# EAGLE board avalon_module (EAGLE 6.2), part 1 of 2
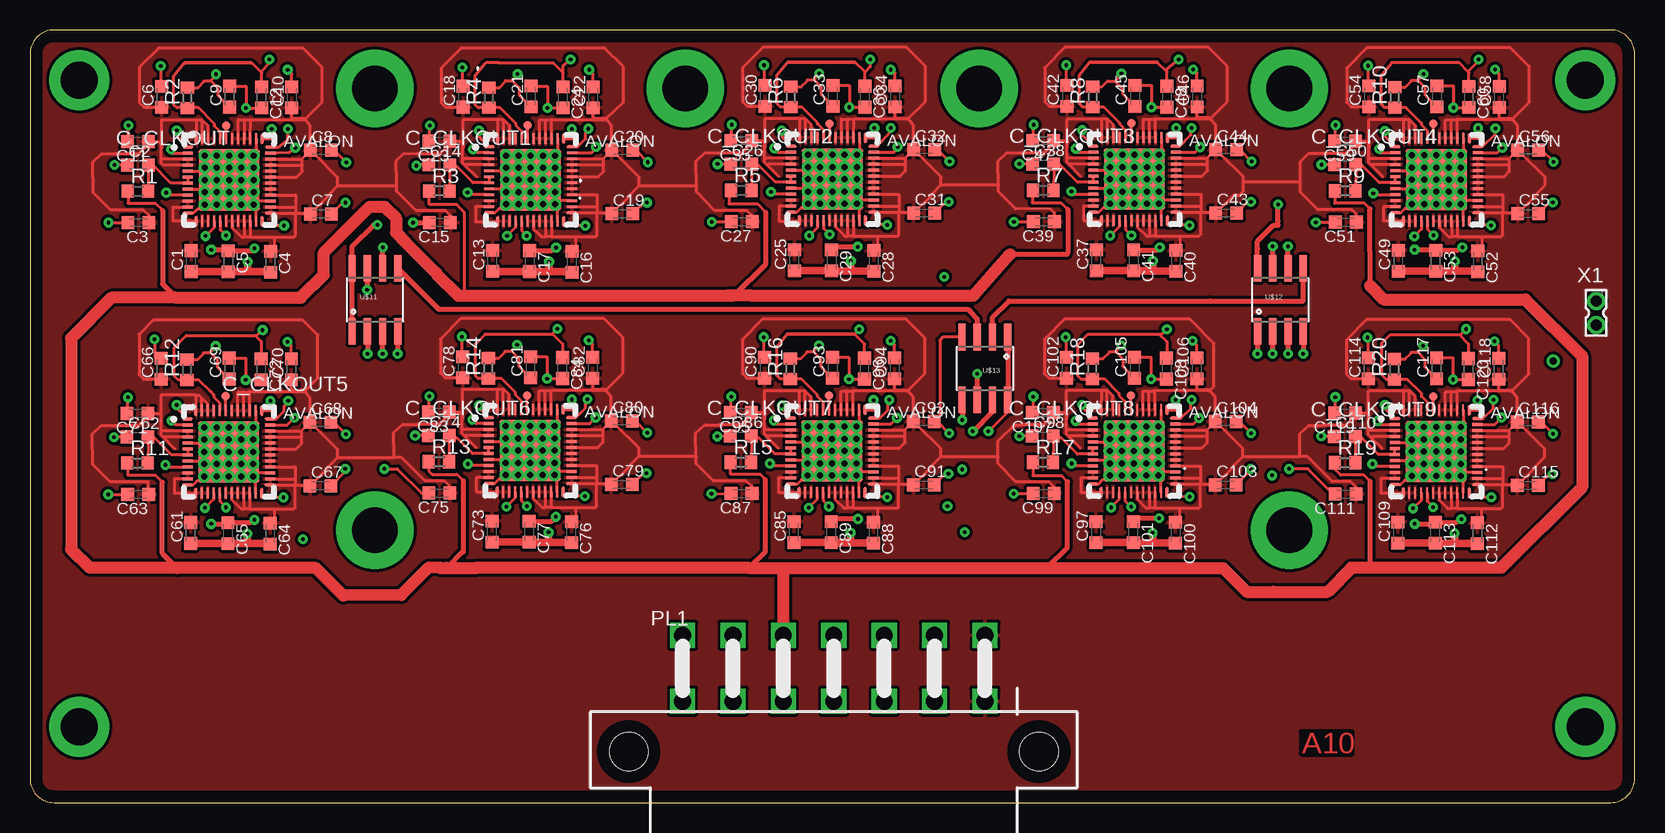
[diagram p7: board, top side]
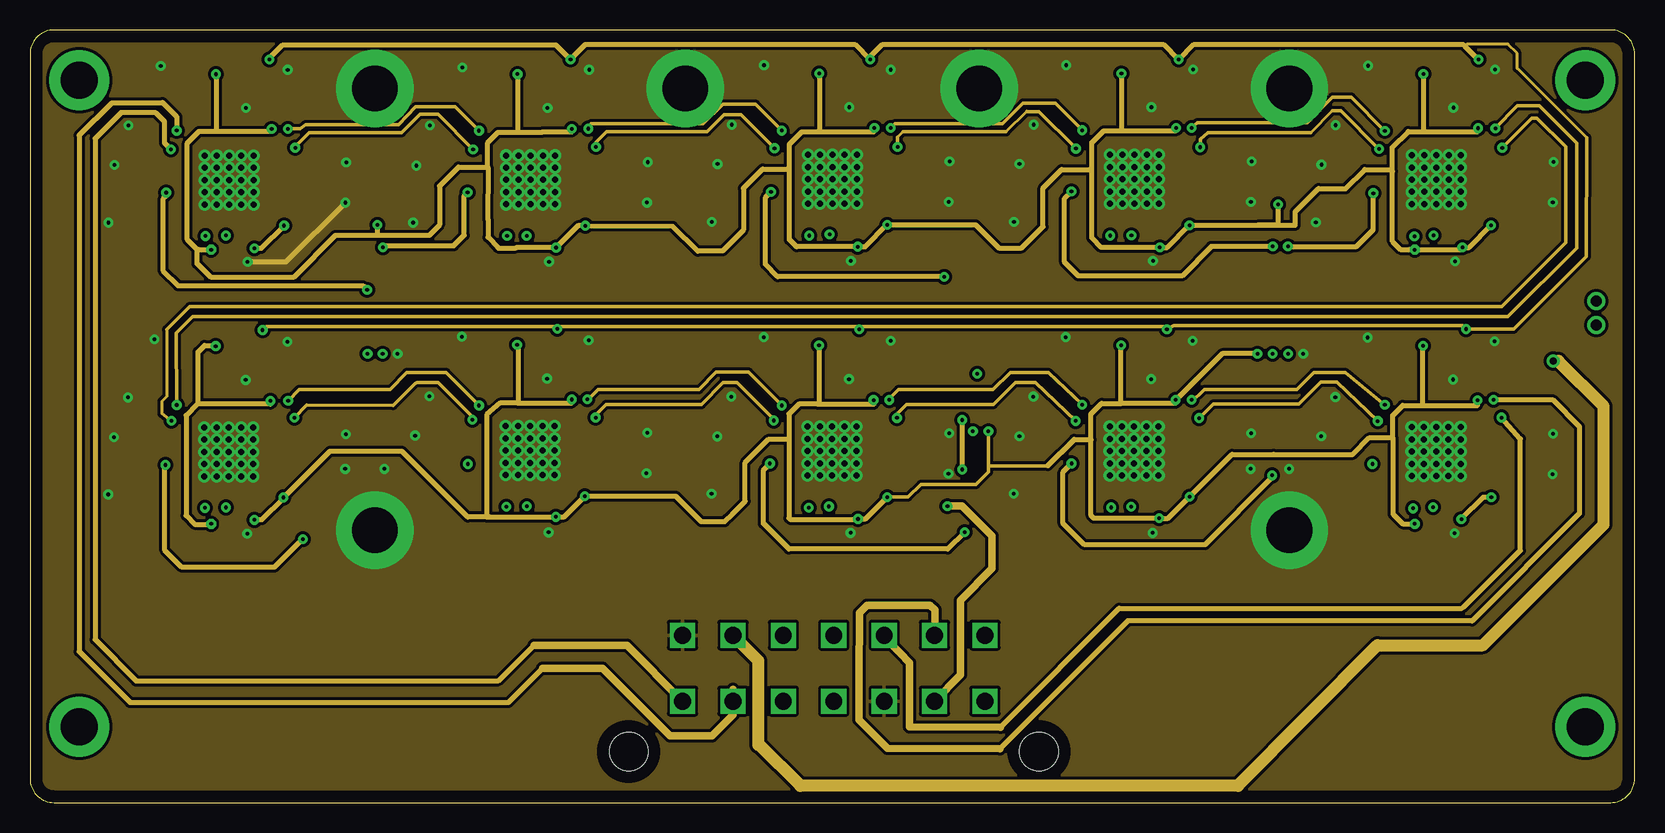
[diagram p8: board, inner layer Route2]
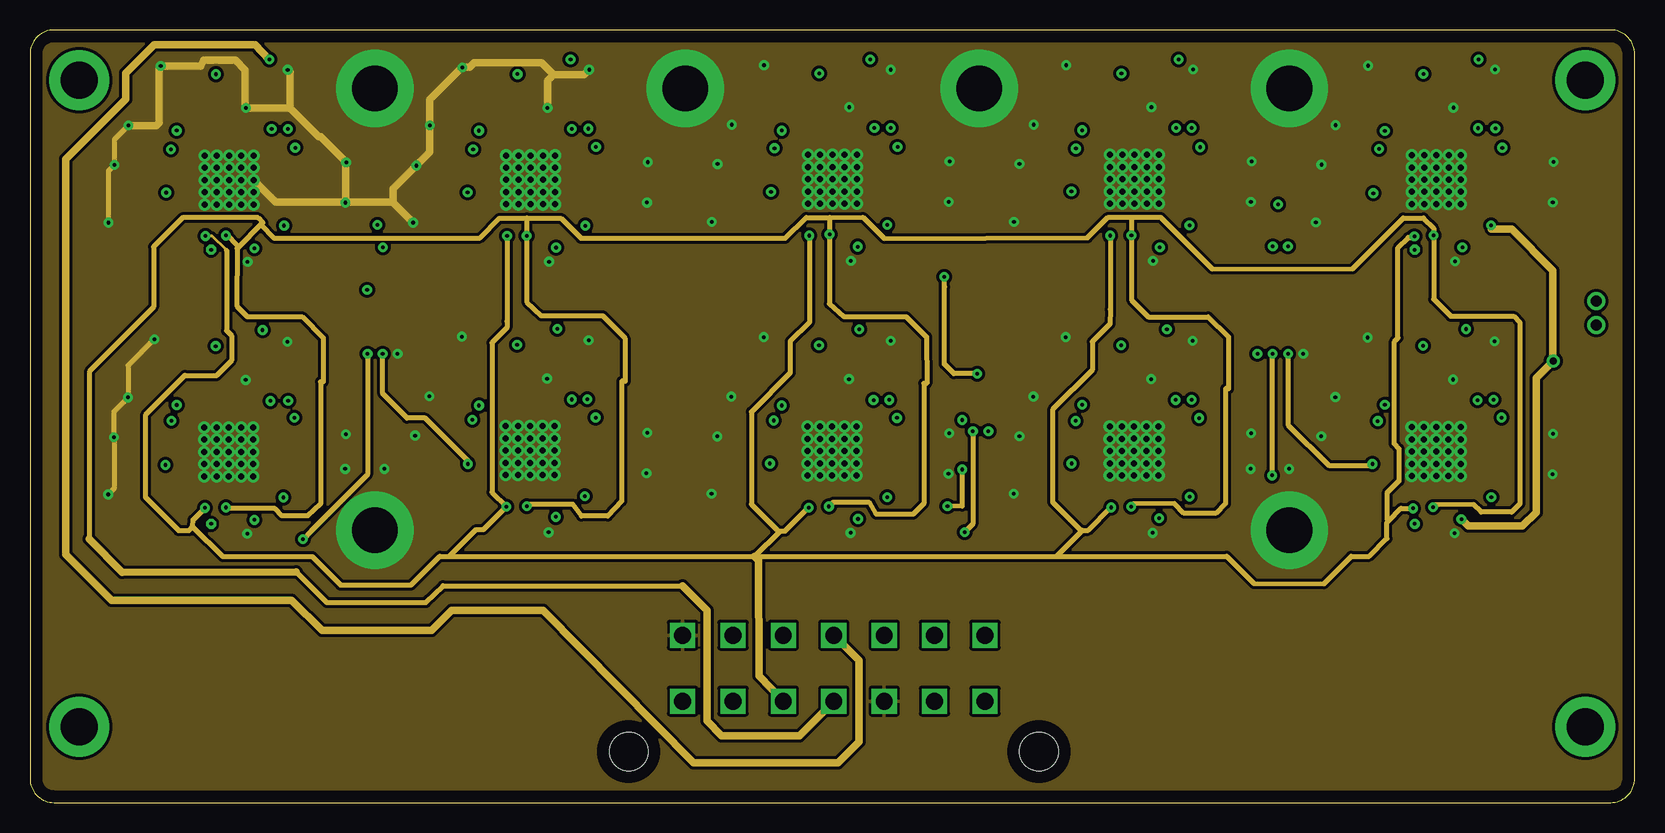
[diagram p9: board, inner layer Route15]
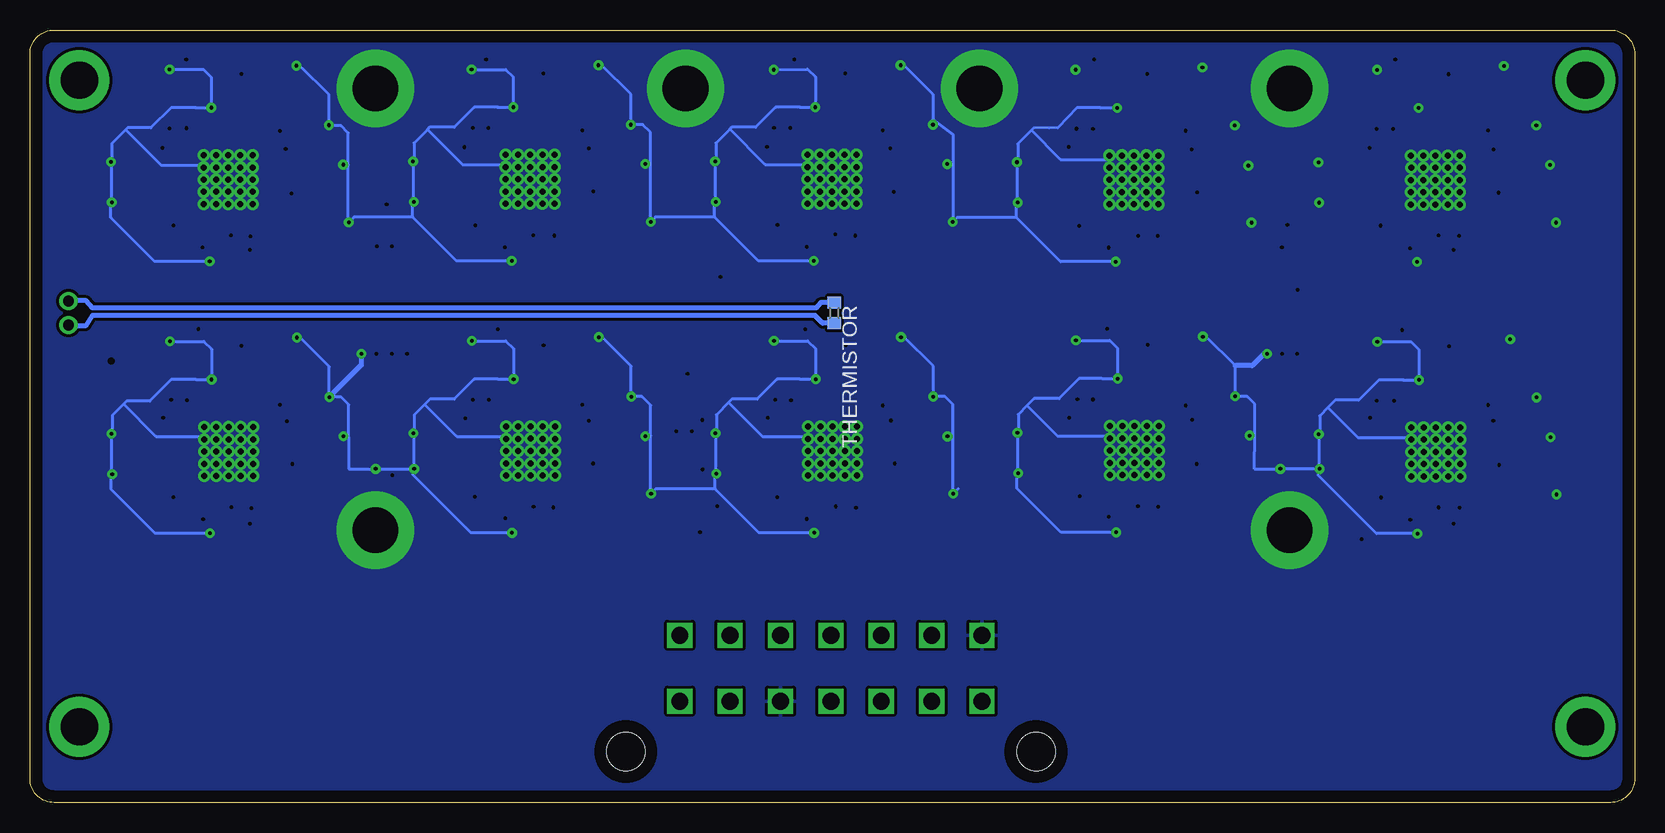
[diagram p10: board, bottom side, seen from below]

Size 133.76 x 64.42 mm. Coordinates in mm from the lower left corner, seen from the top.
Outline: 0,62.42 0,2 arc90 2,0 131.76,0 arc90 133.76,2 133.76,62.42 arc90 131.76,64.42 2,64.42 arc90 0,62.42
Copper layers ((1*2*15)*16): Top 0.035mm / dielectric 1mm / Route2 0.035mm / dielectric 0.3mm / Route15 0.035mm / dielectric 0.3mm / Bottom 0.035mm
Design rules: minimum track width 10mil, minimum drill 24mil, track to track 8mil, track to pad 8mil, pad to pad 8mil, via to via 8mil, smd to smd 8mil, copper to edge 40mil, drill to drill 8mil, minimum pad ring 12mil, minimum via ring 10mil, stop-mask expansion 4mil, vias tented up to drill 0.6mm, thermal gap 10mil

## Footprints (pad centres in the part's own frame; a part is rotated, then mirrored left to right if it is on the bottom)
C0603K = smd 1.05 x 1.08: 1 -0.875,0; 2 0.875,0
TP07R = smd 0.7 x 0.7: TP 0,0
5569-14 = drill 1.4 square: 1 12.6,0; 2 8.4,0; 3 4.2,0; 4 0,0; 5 -4.2,0; 6 -8.4,0; 7 -12.6,0; 8 12.6,5.5; 9 8.4,5.5; 10 4.2,5.5; 11 0,5.5; 12 -4.2,5.5; 13 -8.4,5.5; 14 -12.6,5.5 | hole 3.2: 17.1,-4.2; -17.1,-4.2
R0603 = smd 1 x 1.1: 1 -0.85,0; 2 0.85,0
A3255Q48 = smd 0.925 x 0.25: 1 -3.303,2.54; 2 -3.303,2.04; 3 -3.303,1.54; 4 -3.303,1.04; 5 -3.303,0.54; 6 -3.303,0.04; 7 -3.303,-0.46; 8 -3.303,-0.96; 9 -3.303,-1.46; 10 -3.303,-1.96; 11 -3.303,-2.46; 12 -3.303,-2.96; 25 3.583,-2.96; 26 3.583,-2.46; 27 3.583,-1.96; 28 3.583,-1.46; 29 3.583,-0.96; 30 3.583,-0.46; 31 3.583,0.04; 32 3.583,0.54; 33 3.583,1.04; 34 3.583,1.54; 35 3.583,2.04; 36 3.583,2.54 | smd 0.25 x 0.925: 13 -2.61,-3.652; 14 -2.11,-3.652; 15 -1.61,-3.652; 16 -1.11,-3.652; 17 -0.61,-3.652; 18 -0.11,-3.652; 19 0.39,-3.652; 20 0.89,-3.652; 21 1.39,-3.652; 22 1.89,-3.652; 23 2.39,-3.652; 24 2.89,-3.652; 37 2.89,3.232; 38 2.39,3.232; 39 1.89,3.232; 40 1.39,3.232; 41 0.89,3.232; 42 0.39,3.232; 43 -0.11,3.232; 44 -0.61,3.232; 45 -1.11,3.232; 46 -1.61,3.232; 47 -2.11,3.232; 48 -2.61,3.232 | smd 5.1 x 5.1: 49 0.14,-0.21
SO08 = smd 0.61 x 2.21: 1 -1.905,-2.616; 2 -0.635,-2.616; 3 0.635,-2.616; 4 1.905,-2.616; 5 1.905,2.616; 6 0.635,2.616; 7 -0.635,2.616; 8 -1.905,2.616
332-02 = drill 0.9 pad 1.27: 1 0,-1; 2 0,1

## Placement (x,y rotation side)
C1  470nF  [C0603K]  13.42,45.15 90 top
C2  470nF  [C0603K]  8.99,53.16 0 top
C3  470nF  [C0603K]  9.05,48.36 180 top
C4  470nF  [C0603K]  20.05,45.09 270 top
C5  470nF  [C0603K]  16.53,45.14 270 top
C6  470nF  [C0603K]  10.97,58.85 90 top
C7  470nF  [C0603K]  24.24,49.08 0 top
C8  470nF  [C0603K]  24.24,54.38 0 top
C9  470nF  [C0603K]  16.64,58.86 90 top
C10  470nF  [C0603K]  21.82,58.8 90 top
C11  470nF  [C0603K]  9,55.12 180 top
C12  470nF  [C0603K]  19.3,58.79 270 top
C13  470nF  [C0603K]  38.55,45.16 90 top
C14  470nF  [C0603K]  34.12,53.17 0 top
C15  470nF  [C0603K]  34.18,48.37 180 top
C16  470nF  [C0603K]  45.18,45.1 270 top
C17  470nF  [C0603K]  41.66,45.15 270 top
C18  470nF  [C0603K]  36.1,58.86 90 top
C19  470nF  [C0603K]  49.37,49.09 0 top
C20  470nF  [C0603K]  49.37,54.39 0 top
C21  470nF  [C0603K]  41.77,58.87 90 top
C22  470nF  [C0603K]  46.95,58.81 90 top
C23  470nF  [C0603K]  34.13,55.13 180 top
C24  470nF  [C0603K]  44.43,58.8 270 top
C25  470nF  [C0603K]  63.71,45.22 90 top
C26  470nF  [C0603K]  59.28,53.23 0 top
C27  470nF  [C0603K]  59.34,48.43 180 top
C28  470nF  [C0603K]  70.34,45.16 270 top
C29  470nF  [C0603K]  66.82,45.21 270 top
C30  470nF  [C0603K]  61.26,58.92 90 top
C31  470nF  [C0603K]  74.53,49.15 0 top
C32  470nF  [C0603K]  74.53,54.45 0 top
C33  470nF  [C0603K]  66.93,58.93 90 top
C34  470nF  [C0603K]  72.11,58.87 90 top
C35  470nF  [C0603K]  59.29,55.19 180 top
C36  470nF  [C0603K]  69.59,58.86 270 top
C37  470nF  [C0603K]  88.89,45.22 90 top
C38  470nF  [C0603K]  84.46,53.23 0 top
C39  470nF  [C0603K]  84.52,48.43 180 top
C40  470nF  [C0603K]  95.52,45.16 270 top
C41  470nF  [C0603K]  92,45.21 270 top
C42  470nF  [C0603K]  86.44,58.92 90 top
C43  470nF  [C0603K]  99.71,49.15 0 top
C44  470nF  [C0603K]  99.71,54.45 0 top
C45  470nF  [C0603K]  92.11,58.93 90 top
C46  470nF  [C0603K]  97.29,58.87 90 top
C47  470nF  [C0603K]  84.47,55.19 180 top
C48  470nF  [C0603K]  94.77,58.86 270 top
C49  470nF  [C0603K]  114.06,45.18 90 top
C50  470nF  [C0603K]  109.63,53.19 0 top
C51  470nF  [C0603K]  109.69,48.39 180 top
C52  470nF  [C0603K]  120.69,45.12 270 top
C53  470nF  [C0603K]  117.17,45.17 270 top
C54  470nF  [C0603K]  111.61,58.88 90 top
C55  470nF  [C0603K]  124.88,49.11 0 top
C56  470nF  [C0603K]  124.88,54.41 0 top
C57  470nF  [C0603K]  117.28,58.89 90 top
C58  470nF  [C0603K]  122.46,58.83 90 top
C59  470nF  [C0603K]  109.64,55.15 180 top
C60  470nF  [C0603K]  119.94,58.82 270 top
C61  470nF  [C0603K]  13.39,22.48 90 top
C62  470nF  [C0603K]  8.96,30.49 0 top
C63  470nF  [C0603K]  9.02,25.69 180 top
C64  470nF  [C0603K]  20.02,22.42 270 top
C65  470nF  [C0603K]  16.5,22.47 270 top
C66  470nF  [C0603K]  10.94,36.18 90 top
C67  470nF  [C0603K]  24.21,26.41 0 top
C68  470nF  [C0603K]  24.21,31.71 0 top
C69  470nF  [C0603K]  16.61,36.19 90 top
C70  470nF  [C0603K]  21.79,36.13 90 top
C71  470nF  [C0603K]  8.97,32.45 180 top
C72  470nF  [C0603K]  19.27,36.12 270 top
C73  470nF  [C0603K]  38.51,22.59 90 top
C74  470nF  [C0603K]  34.08,30.6 0 top
C75  470nF  [C0603K]  34.14,25.8 180 top
C76  470nF  [C0603K]  45.14,22.53 270 top
C77  470nF  [C0603K]  41.62,22.58 270 top
C78  470nF  [C0603K]  36.06,36.29 90 top
C79  470nF  [C0603K]  49.33,26.52 0 top
C80  470nF  [C0603K]  49.33,31.82 0 top
C81  470nF  [C0603K]  41.73,36.3 90 top
C82  470nF  [C0603K]  46.91,36.24 90 top
C83  470nF  [C0603K]  34.09,32.56 180 top
C84  470nF  [C0603K]  44.39,36.23 270 top
C85  470nF  [C0603K]  63.68,22.55 90 top
C86  470nF  [C0603K]  59.25,30.56 0 top
C87  470nF  [C0603K]  59.31,25.76 180 top
C88  470nF  [C0603K]  70.31,22.49 270 top
C89  470nF  [C0603K]  66.79,22.54 270 top
C90  470nF  [C0603K]  61.23,36.25 90 top
C91  470nF  [C0603K]  74.5,26.48 0 top
C92  470nF  [C0603K]  74.5,31.78 0 top
C93  470nF  [C0603K]  66.9,36.26 90 top
C94  470nF  [C0603K]  72.08,36.2 90 top
C95  470nF  [C0603K]  59.26,32.52 180 top
C96  470nF  [C0603K]  69.56,36.19 270 top
C97  470nF  [C0603K]  88.86,22.55 90 top
C98  470nF  [C0603K]  84.43,30.56 0 top
C99  470nF  [C0603K]  84.49,25.76 180 top
C100  470nF  [C0603K]  95.49,22.49 270 top
C101  470nF  [C0603K]  91.97,22.54 270 top
C102  470nF  [C0603K]  86.41,36.25 90 top
C103  470nF  [C0603K]  99.68,26.48 0 top
C104  470nF  [C0603K]  99.68,31.78 0 top
C105  470nF  [C0603K]  92.08,36.26 90 top
C106  470nF  [C0603K]  97.26,36.2 90 top
C107  470nF  [C0603K]  84.44,32.52 180 top
C108  470nF  [C0603K]  94.74,36.19 270 top
C109  470nF  [C0603K]  114.03,22.51 90 top
C110  470nF  [C0603K]  109.6,30.52 0 top
C111  470nF  [C0603K]  109.66,25.72 180 top
C112  470nF  [C0603K]  120.66,22.45 270 top
C113  470nF  [C0603K]  117.14,22.5 270 top
C114  470nF  [C0603K]  111.58,36.21 90 top
C115  470nF  [C0603K]  124.85,26.44 0 top
C116  470nF  [C0603K]  124.85,31.74 0 top
C117  470nF  [C0603K]  117.25,36.22 90 top
C118  470nF  [C0603K]  122.43,36.16 90 top
C119  470nF  [C0603K]  109.61,32.48 180 top
C120  470nF  [C0603K]  119.91,36.15 270 top
C_CLKOUT  PTR1TP07R  [TP07R]  16.36,56.46 180 top
C_CLKOUT1  PTR1TP07R  [TP07R]  41.48,56.48 180 top
C_CLKOUT2  PTR1TP07R  [TP07R]  66.65,56.62 180 top
C_CLKOUT3  PTR1TP07R  [TP07R]  91.82,56.64 180 top
C_CLKOUT4  PTR1TP07R  [TP07R]  116.99,56.59 180 top
C_CLKOUT5  PTR1TP07R  [TP07R]  16.32,33.88 0 top
C_CLKOUT6  PTR1TP07R  [TP07R]  41.45,33.95 180 top
C_CLKOUT7  PTR1TP07R  [TP07R]  66.62,33.96 180 top
C_CLKOUT8  PTR1TP07R  [TP07R]  91.79,33.94 180 top
C_CLKOUT9  PTR1TP07R  [TP07R]  116.96,33.84 180 top
PL1  [5569-14]  67,8.45 0 top
R1  75  [R0603]  9,50.98 0 top
R2  100K  [R0603]  13.12,58.76 90 top
R3  75  [R0603]  34.13,50.99 0 top
R4  100K  [R0603]  38.25,58.77 90 top
R5  75  [R0603]  59.29,51.05 0 top
R6  100K  [R0603]  63.41,58.83 90 top
R7  75  [R0603]  84.47,51.05 0 top
R8  100K  [R0603]  88.59,58.83 90 top
R9  75  [R0603]  109.64,51.01 0 top
R10  100K  [R0603]  113.76,58.79 90 top
R11  75  [R0603]  8.97,28.31 0 top
R12  100K  [R0603]  13.09,36.09 90 top
R13  75  [R0603]  34.09,28.42 0 top
R14  100K  [R0603]  38.21,36.2 90 top
R15  75  [R0603]  59.26,28.38 0 top
R16  100K  [R0603]  63.38,36.16 90 top
R17  75  [R0603]  84.44,28.38 0 top
R18  100K  [R0603]  88.56,36.16 90 top
R19  75  [R0603]  109.61,28.34 0 top
R20  100K  [R0603]  113.73,36.12 90 top
THERMISTOR  100K  [R0603]  66.72,40.82 270 bottom
U$1  A3255Q48  [A3255Q48]  16.46,52.12 0 top
U$2  A3255Q48  [A3255Q48]  41.59,52.13 0 top
U$3  A3255Q48  [A3255Q48]  66.75,52.19 0 top
U$4  A3255Q48  [A3255Q48]  91.93,52.19 0 top
U$5  A3255Q48  [A3255Q48]  117.1,52.15 0 top
U$6  A3255Q48  [A3255Q48]  16.43,29.45 0 top
U$7  A3255Q48  [A3255Q48]  41.55,29.56 0 top
U$8  A3255Q48  [A3255Q48]  66.72,29.52 0 top
U$9  A3255Q48  [A3255Q48]  91.9,29.52 0 top
U$10  A3255Q48  [A3255Q48]  117.07,29.48 0 top
U$11  NB3L553  [SO08]  28.76,41.92 0 top
U$12  NB3L553  [SO08]  104.23,41.92 0 top
U$13  NB3L553  [SO08]  79.6,36.2 180 top
X1  332-02  [332-02]  130.55,40.82 180 top

## Tracks (layer width: path | path; a pad name or v marks a point on that pad's centre or on a via)
$1
  Top 0.254: R3.2 34.99,52.73 C14.2 34.94,53.19 34.98,53.15 35.46,53.15 36.88,51.73 36.93,51.68 U$2.7 U$2.6
$2
  Top 0.254: R5.2 60.16,52.79 C26.2 60.63,53.23 62.09,51.78 62.12,51.74 U$3.7 U$3.6
$3
  Top 0.254: R1.2 9.87,52.72 C2.2 10.17,53.16 10.17,53.22 11.74,51.66 U$1.7 U$1.6
$4
  Top 0.254: R7.2 85.33,52.79 C38.2 85.83,53.23 87.33,51.73 U$4.7 U$4.6
$5
  Top 0.254: R9.2 110.5,52.75 C50.2 110.98,53.2 112.47,51.71 112.49,51.69 U$5.7 U$5.6
$6
  Top 0.254: R11.2 9.83,30.05 C62.2 9.89,30.43 10.36,30.43 11.8,28.99 U$6.7 U$6.6
$7
  Top 0.254: R13.2 34.95,30.16 C74.2 35.17,30.38 35.6,30.38 36.88,29.1 U$7.7 U$7.6
$8
  Top 0.254: R15.2 60.12,30.12 C86.2 60.3,30.39 60.76,30.4 62.09,29.07 U$8.7 U$8.6
$9
  Top 0.254: R17.2 85.3,30.12 C98.2 85.42,30.44 85.92,30.44 87.3,29.06 U$9.7 U$9.6
$10
  Top 0.254: R19.2 110.47,30.08 C110.2 110.59,30.4 111.03,30.4 112.41,29.02 U$10.7 U$10.6
AVCC1V2
  Top 0.254: R1.1 8.18,50.98 8.18,49.97 10.45,49.97 11.06,49.39 | R3.1 33.28,49.87 35.57,49.87 36.2,49.21 36.2,42.29 35.71,42.27 | R5.1 58.27,51.05 58.27,49.92 60.64,49.92 61.35,49.21 | R7.1 83.55,51.05 83.55,50.02 85.93,50.02 86.52,49.45 | R9.1 108.76,51.01 108.76,49.97 108.77,49.98 111.23,49.98 111.7,49.51 | R19.1 108.62,28.34 108.62,27.93 109.25,27.3 111.2,27.3 111.71,26.78 | R17.1 83.6,27.24 83.61,27.25 86,27.25 86.49,26.75 | 86.13,19.57 86.03,19.55 86.25,19.52 86.13,19.57 | 86.29,19.57 86.13,19.57 | 86.13,19.57 86.06,19.56 | R13.1 33.24,27.67 33.54,27.37 35.59,27.37 36.12,26.85 | 37.2,19.57 37.21,19.56 | R11.1 8.15,28.31 8.15,27.3 8.16,27.29 10.47,27.29 11.03,26.73 | 34.2,19.56 34.2,19.57 | R15.1 58.4,27.38 58.41,27.37 60.88,27.37 61.3,26.93 | 62.8,19.41 62.65,19.56 | 11.06,43.26 11.13,43.16 | 36.12,20.89 36.06,20.92
  Top 0.406: 11.12,43.14 11.13,43.16 12.2,42.09 | 58.67,42.29 61.35,44.92 61.35,49.21 | 86.52,49.45 86.52,45.85 86.47,45.73 81.69,45.73 | 111.72,19.58 111.72,19.57 | 84.79,19.56 86.48,21.24 86.49,26.75 | 59.95,19.56 61.3,20.91 61.3,26.93 | 36.06,20.92 34.71,19.57 | 12.19,19.59 12.24,19.56 11.03,20.78 11.03,26.73 | 11.06,49.39 11.06,43.26 | 36.12,26.85 36.12,20.89 | 111.72,19.58 111.71,26.78 | 88.34,19.55 | 111.7,49.51 111.7,45.91 111.7,43.09 | 111.73,19.57 111.72,19.58
  Top 1.016: 58.06,42.27 35.71,42.27 33.87,44.11 33.87,44.15 31.29,46.75 30.5,47.54 30.5,48.76 29.58,49.68 28.33,49.68 24.49,45.84 24.49,44 22.58,42.09 12.2,42.09 6.79,42.09 3.43,38.73 3.43,21.12 4.98,19.59 12.19,19.59 | 58.06,42.27 58.67,42.29 | 111.72,19.57 110.13,19.57 108.18,17.58 103.62,17.57 101.43,17.58 99.45,19.55 88.34,19.55 | 86.03,19.55 88.34,19.55 | 86.06,19.56 84.79,19.56 62.65,19.56 59.95,19.56 37.21,19.56 | 34.2,19.57 34.71,19.57 37.2,19.57 | PL1.12 62.8,19.41 | 34.2,19.56 33.24,19.59 30.95,17.3 26.12,17.27 23.83,19.56 12.24,19.56 | 81.69,45.73 78.64,42.27 60.18,42.27 58.08,42.27 58.06,42.27 | 111.7,43.09 112.83,41.96 124.66,41.96 129.38,37.24 129.38,26.29 122.66,19.57 111.73,19.57
AVCC3V3  (via drill 0.3 layers 1-15, 0.3 pad 0.25 layers 1-15, 0.3 pad 0.3 layers 1-15, 0.6 layers 1-15)
  Top 0.254: R2.2 14,59.61 14.53,60.14 14.53,60.16 14.5,60.19 15.06,60.19 | 15.06,60.19 15.65,59.6 15.65,58.98 C9.1 | U$1.37 20.15,55.35 v20.15,56.18 | v15.51,60.73 15.51,60.64 15.06,60.19 | R4.2 39.13,59.62 39.66,60.15 39.66,60.17 39.63,60.2 40.19,60.2 | 40.19,60.2 40.78,59.61 40.78,58.99 C21.1 | U$2.37 45.2,55.36 v45.16,56.18 | v40.64,60.74 40.64,60.65 40.19,60.2 | R6.2 64.29,59.68 64.82,60.21 64.82,60.23 64.79,60.26 65.35,60.26 | 65.35,60.26 65.94,59.67 65.94,59.05 C33.1 | U$3.37 70.36,55.42 v70.39,56.25 | v65.8,60.8 65.8,60.71 65.35,60.26 | C45.1 91.12,59.05 91.12,59.48 90.44,60.16 | U$4.37 95.54,55.42 v95.54,56.26 | 90.98,60.71 v90.98,60.8 91.12,60.66 90.94,60.66 90.44,60.16 | R10.2 114.64,59.64 115.17,60.17 115.17,60.19 115.14,60.22 115.7,60.22 | 115.7,60.22 116.29,59.63 116.29,59.01 C57.1 | U$5.37 120.71,55.38 v120.72,56.23 | v116.15,60.76 116.15,60.67 115.7,60.22 | R20.2 114.61,36.97 115.14,37.5 115.14,37.52 115.11,37.55 115.67,37.55 | 115.67,37.55 116.26,36.96 116.26,36.34 C117.1 | U$10.37 120.68,32.71 v120.67,33.55 | v116.12,38.09 116.12,38 115.67,37.55 | R18.2 89.44,37.01 89.97,37.54 89.97,37.56 89.94,37.59 90.5,37.59 | 90.5,37.59 91.09,37 91.09,36.38 C105.1 | U$9.37 95.51,32.75 v95.51,33.57 | v90.95,38.13 90.95,38.04 90.5,37.59 | R16.2 64.26,37.01 64.79,37.54 64.79,37.56 64.76,37.59 65.32,37.59 | 65.32,37.59 65.91,37 65.91,36.38 C93.1 | U$8.37 70.33,32.75 v70.32,33.56 | v65.77,38.13 65.77,38.04 65.32,37.59 | R14.2 39.09,37.05 39.62,37.58 39.62,37.6 39.59,37.63 40.15,37.63 | 40.15,37.63 40.74,37.04 40.74,36.42 C81.1 | U$7.37 45.16,32.79 v45.16,33.61 | v40.6,38.17 40.6,38.08 40.15,37.63
  Top 0.254: R12.2 13.97,36.94 14.5,37.47 14.5,37.49 14.47,37.52 15.03,37.52 | 15.03,37.52 15.62,36.93 15.62,36.31 C69.1 | U$6.37 20.04,32.68 v20.04,33.49 | v15.48,38.06 15.48,37.97 15.03,37.52 | 116.7,23.24 C113.1 | 116.7,46.1 C53.1 | 16.37,23.24 C65.1 | 16.37,46.1 C5.1 | 18.59,46.02 v18.71,46.22 | v21.18,48.11 19.35,48.12 U$1.24 | 44.5,48.46 U$2.24 44.48,48.1 v46.3,48.1 | v21.13,25.44 19.31,25.43 U$6.24 | v71.45,48.17 69.65,48.18 U$3.24 | v96.65,48.14 94.82,48.14 U$4.24 | v121.8,48.13 119.99,48.13 U$5.24 | v46.26,25.55 44.44,25.54 U$7.24 | v71.47,25.47 69.6,25.48 U$8.24 | v96.67,25.51 94.79,25.49 U$9.24 | v121.81,25.45 119.96,25.46 U$10.24 | C29.1 66.82,46.26 66.91,46.35 | 91.97,23.7 C101.1 | 66.79,23.65 C89.1 | R8.2 89.34,59.68 89.82,60.16 90.44,60.16 | U$13.8 81.5,32.58 v79.89,30.96
  Top 0.305: 70.34,55.96 v70.39,56.25 70.37,55.96 | v95.54,56.26 95.53,55.96 95.52,55.96 | v120.67,33.55 120.67,33.25 120.66,33.25
  Top 0.406: v115.43,23.24 116.7,23.24 | v115.43,46.1 116.7,46.1 | v15.1,46.1 16.37,46.1 | C5.1 18.59,46.02 | C17.1 43.53,46.03 v43.85,46.27 | v18.7,23.57 18.31,23.35 C65.1 16.5,23.24 v15.1,23.24 | C53.1 119.02,46.05 v119.4,46.29 | C113.1 118.91,23.38 v119.32,23.64 | 66.91,46.35 v69.01,46.35 | C41.1 93.97,46.09 v94.18,46.29 | v94.13,23.7 91.97,23.7 | v69.02,23.65 66.79,23.65 | C77.1 43.46,23.46 v43.83,23.82 | v28.95,48.18 28.64,48.18 28.64,48.16 26.86,46.4 U$11.8 U$11.1 | U$12.8 102.32,46.19 102.32,46.8 103.66,48.14 104.03,48.14 104.03,48.47 v104.03,49.88 | U$13.1 U$13.8 | U$12.1 102.33,37.4 v102.32,37.43
  Route2 0.254: 70.34,55.94 v70.39,56.25 | 95.48,56.02 v95.54,56.26 | 13.92,46.12 14.06,46.12 13.92,45.98 | 15.08,46.12 v15.1,46.1 15.13,46.07 | 65.8,56.09 65.65,55.94 | 63.11,52.83 63.3,52.65 | 88.33,52.79 88.52,52.6 | 120.69,55.9 v120.72,56.23 120.67,55.96 | 113.5,52.78 113.56,52.84 | 42.68,55.88 42.7,55.9 | 40.64,56.02 40.78,55.88 | 19.98,55.98 v20.15,56.18 | 15.51,56.04 15.57,55.98 | 90.98,56.08 90.92,56.02 | 38.21,52.86 38.16,52.99 | 46.33,48.07 v46.3,48.1 | 21.22,48.07 v21.18,48.11 | 15.43,38.11 v15.48,38.06 | 15.07,23.21 v15.1,23.24 | v21.13,25.44 21.13,25.37 | 14.02,33.3 13.94,33.22 | v40.6,38.17 40.68,38.17 | 45.16,33.3 v45.16,33.61 45.13,33.3 | 65.75,33.23 65.67,33.23 65.77,33.33 | 68.96,23.59 v69.02,23.65 | 58.6,24.06 58.58,24.09 | 70.33,33.23 v70.32,33.56 | 90.97,33.29 90.95,33.29 | v94.14,23.7 v94.13,23.7 | 95.49,33.29 v95.51,33.57 | 113.64,30.36 113.6,30.4 | 94.87,23.7 94.87,23.71 | v115.42,46.11 v115.43,46.1
  Route2 0.305: v71.47,25.47 73.2,25.47 74.26,26.53 78.08,26.53 78.85,26.53 79.88,27.56 79.88,28.08 | 79.88,28.08 v79.88,30.95 v79.89,30.96 | 84.83,28.07 79.89,28.07 79.88,28.08
  Route2 0.406: 70.34,55.94 65.65,55.94 64.34,55.94 63.31,54.89 63.3,52.65 63.3,46.94 63.91,46.35 v69.01,46.35 69.63,46.35 v71.45,48.17 78.83,48.17 80.76,46.24 82.66,46.24 84.44,48.02 84.44,51.24 85.99,52.79 88.33,52.79 | 95.48,56.02 90.92,56.02 89.51,56.02 88.52,55.03 88.52,52.6 88.52,47.07 89.29,46.29 v94.18,46.29 94.8,46.29 v96.65,48.14 102.3,48.14 | 13.92,46.12 13.11,46.93 13.11,55 14.09,55.98 15.57,55.98 19.98,55.98 | 14.06,46.12 15.08,46.12 | v65.8,60.8 65.8,56.09 | v46.3,48.1 45.68,48.1 v43.85,46.27 40.51,46.27 40.49,46.25 38.98,46.25 39.02,46.29 38.18,47.13 38.18,48.63 38.21,52.86 | v121.81,25.45 121.13,25.45 v119.32,23.64 | v69.02,23.65 69.65,23.65 v71.47,25.47 | 28.95,47.29 33.29,47.29 34.13,48.16 34.13,51.41 35.71,52.99 38.16,52.99 38.16,55.02 39.02,55.88 40.78,55.88 42.68,55.88 | 28.95,47.29 25.44,47.29 21.96,43.78 15.11,43.78 13.92,44.92 13.92,45.98 | 63.11,52.83 61.08,52.83 59.47,51.22 59.47,47.74 57.73,46 55.65,45.97 53.58,48.04 46.33,48.07 | 102.3,48.14 104.03,48.14 | 104.03,48.14 105.33,48.14 105.46,48.14 105.46,49.26 107.4,51.2 109.65,51.2 109.66,51.19 111.25,52.78 113.5,52.78 113.57,52.64 113.57,46.78 114.24,46.11 v115.42,46.11 | 113.56,52.84 113.56,54.64 114.88,55.96 116.15,55.96 | 116.15,55.96 120.67,55.96 | v45.16,56.18 v45.17,56.18 45.17,55.91 42.7,55.9 | v40.64,60.74 40.64,56.02 | v15.51,60.73 15.51,56.04 | 114.95,46.1 v115.43,46.1 119.21,46.1 v119.4,46.29 119.96,46.29 v121.8,48.13 | v116.15,60.76 116.15,55.96 | v90.98,60.8 90.98,56.08 | v18.71,46.22 19.29,46.22 v21.18,48.11 | 14.02,33.3 14.02,37.58 14.55,38.11 15.43,38.11 | v20.04,33.49 20.04,33.23 13.94,33.22 13,32.28 13,23.92 13.71,23.21 15.07,23.21
  Route2 0.406: 21.13,25.37 19.33,23.58 18.86,23.58 v18.7,23.57 18.65,23.62 | 40.68,38.17 40.68,33.3 | 40.68,33.3 39.18,33.3 38.08,32.36 38.08,23.8 | 38.08,23.8 38.37,23.81 36.48,23.81 31,29.29 24.98,29.29 v21.13,25.44 | 38.08,23.8 43.4,23.81 v43.83,23.82 44.53,23.82 v46.26,25.55 53.82,25.55 55.95,23.42 57.91,23.42 58.58,24.09 59.61,25.12 59.61,28.34 61.58,30.31 63.27,30.31 | 40.68,33.3 45.13,33.3 | 65.67,33.23 64.1,33.23 63.27,32.4 63.27,30.31 | 63.27,30.31 63.27,23.73 63.41,23.59 68.96,23.59 | v65.77,38.13 65.77,33.33 | 65.75,33.23 70.33,33.23 | 95.49,33.29 90.97,33.29 89.33,33.29 88.43,32.4 88.42,30.29 | 90.95,33.29 v90.95,38.13 | 84.83,28.07 87.05,30.29 88.42,30.29 | 88.42,30.29 88.45,30.26 88.45,23.93 88.68,23.7 v94.13,23.7 94.87,23.7 | 116.12,33.11 v116.12,38.09 116.16,38.05 | 116.12,33.11 120.68,33.11 v120.67,33.55 | 116.12,33.11 114.42,33.11 113.6,32.29 113.6,30.4 113.58,30.4 113.58,30.41 113.55,30.44 111.66,30.44 110.28,29.04 103.66,29.03 100.19,29.03 v96.67,25.51 94.87,23.71 | 113.64,30.36 113.64,24.03 114.43,23.24 v115.43,23.24 | v28.95,48.18 28.95,47.29 | v104.03,49.88 104.03,48.14 | 104.03,48.14 102.3,48.14 | v102.32,37.43 99.38,37.44 98.26,36.32 v95.51,33.57
  Route2 1.016: v126.98,36.82 127.4,36.82 131.17,33.05 131.17,23.17 121.12,13.12 112.33,13.12 100.7,1.38 64.22,1.38 60.76,4.81 60.71,4.81 60.71,11.82 58.6,13.93 PL1.13
  Route15 0.61: v119.32,23.64 119.89,23.07 124.41,23.07 125.55,24.21 125.55,35.39 v126.98,36.82 126.94,36.86 126.94,44.37 123.5,47.81 121.8,47.81 v121.8,48.13
CLK  (via drill 0.3 layers 1-15)
  Top 0.406: U$13.5 77.71,33.58 v77.71,31.9
  Route2 0.406: v77.71,31.9 77.69,31.9 v77.7,27.77
  Route2 0.61: PL1.2 77.55,10.64 77.55,16.84 80.2,19.51 80.2,22.22 78.15,24.27 77.7,24.72 v76.48,24.72
  Route15 0.406: v77.7,27.77 v77.69,27.77 77.69,24.71 v76.48,24.72
CLK1  (via drill 0.3 layers 1-15)
  Top 0.254: U$1.9 11.55,50.66 v11.35,50.86
  Top 0.406: U$11.7 28.1,44.54 v28.1,42.76
  Route2 0.406: v11.35,50.86 11.35,50.58 11.07,50.3 11.07,44.36 12.34,43.09 27.77,43.09 v28.1,42.76
CLK2  (via drill 0.3 layers 1-15)
  Top 0.254: 36.74,50.68 36.54,50.88 v36.48,50.88 36.69,50.67 U$2.9
  Top 0.406: U$11.6 v29.41,46.29
  Route2 0.406: v29.41,46.29 29.41,46.24 29.61,46.44 35.33,46.44 36.19,47.3 36.19,50.59 v36.48,50.88
CLK3  (via drill 0.3 layers 1-15)
  Top 0.254: U$3.9 61.91,50.73 v61.77,50.92
  Top 0.406: U$13.6 78.97,35.75 v78.95,35.76
  Route2 0.406: v76.2,43.84 62.33,43.84 61.31,44.88 61.32,50.47 v61.77,50.92
  Route15 0.406: v78.95,35.76 77.01,35.76 76.21,36.56 76.21,39.74 76.24,43 76.24,43.82 v76.2,43.84
CLK4  (via drill 0.3 layers 1-15)
  Top 0.254: v86.81,50.95 86.81,50.92 86.99,50.74 88.62,50.74 U$4.9
  Top 0.406: U$12.7 103.59,46.33 v103.6,46.37
  Route2 0.406: v103.6,46.37 98.47,46.37 96.05,43.91 87.38,43.91 86.24,45.05 86.24,50.39 v86.81,50.95
CLK5  (via drill 0.3 layers 1-15)
  Top 0.254: v111.98,50.81 v111.97,50.81 112.08,50.7 113.79,50.7 U$5.9
  Top 0.406: U$12.6 v104.86,46.37
  Route2 0.406: v104.86,46.37 110.57,46.37 111.97,47.77 v111.97,50.8 v111.98,50.81
CLK6  (via drill 0.3 layers 1-15)
  Top 0.254: v11.3,28.15 11.28,28.15 11.28,27.99 U$6.9
  Top 0.406: U$11.2 28.14,38.26 v28.14,37.43
  Route2 0.406: v22.76,21.96 22.67,21.95 20.36,19.62 12.65,19.62 11.24,21.03 11.24,28.09 v11.3,28.15
  Route15 0.406: v28.14,37.43 28.14,27.35 23.42,22.63 v22.76,21.96
CLK7  (via drill 0.3 layers 1-15)
  Top 0.254: U$7.9 36.63,28.1 v36.5,28.23 | U$11.3
  Top 0.406: v29.4,37.43 U$11.3
  Route15 0.406: v36.5,28.23 36.5,28.5 32.94,32.06 31.43,32.06 29.4,34.09 v29.4,37.43
CLK8  (via drill 0.3 layers 1-15)
  Top 0.254: U$8.9 61.76,28.06 61.76,28.19 v61.68,28.27
  Top 0.406: U$13.7 80.23,32.62 v78.6,30.96
  Route2 0.406: v77.91,22.54 v77.92,22.54 76.51,21.13 63.27,21.13 61.14,23.26 61.15,27.74 v61.68,28.27
  Route15 0.406: v78.6,30.96 78.6,23.23 v77.91,22.54
CLK9  (via drill 0.3 layers 1-15)
  Top 0.254: 87,28.06 86.83,28.25 v86.82,28.27 86.99,28.06 U$9.9
  Top 0.406: U$12.2 v103.58,37.43
  Route2 0.406: v103.54,27.28 103.54,27.09 97.94,21.49 87.9,21.49 86.12,23.27 86.11,27.55 v86.82,28.27
  Route15 0.406: v103.58,37.43 103.54,37.52 v103.54,27.28
CLK10  (via drill 0.3 layers 1-15)
  Top 0.254: U$10.9 111.98,28.02 111.98,28.15 v111.9,28.23
  Top 0.406: U$12.3 v104.87,37.43
  Route15 0.406: v104.87,37.43 104.87,31.5 108.27,28.12 111.78,28.11 v111.9,28.23
CLK_IO1
  Top 0.406: U$11.5 30.67,44.54 34.08,41.13 50.86,41.13 78.17,41.13 78.38,40.92 78.97,40.34 U$13.3
CLK_IO2
  Top 0.406: U$13.2 80.23,40.47 81.6,41.83 98.37,41.83 106.14,41.83 U$12.5
CONFIG_N  (via drill 0.3 layers 1-15)
  Top 0.254: U$1.2 11.86,54.16 11.86,54.35 v11.76,54.45
  Route2 0.406: v11.76,54.45 11.19,55.02 11.19,56.8 10.49,57.51 7.6,57.53 5.43,55.37 5.43,13.59 8.84,10.13 39.06,10.16 42.04,13.11
  Route2 0.61: 42.04,13.11 49.76,13.11 PL1.7
CONFIG_N1  (via drill 0.3 layers 1-15)
  Top 0.254: U$2.2 37.34,54.17 v36.94,54.46 | v22.11,54.6 21.57,54.18 20.64,54.16 U$1.35
  Route2 0.254: v22.11,54.6 22.11,54.69
  Route2 0.305: 22.11,54.69 23.26,55.84 30.98,55.84 32.53,57.38 34.02,57.38 v36.94,54.46
CONFIG_N2  (via drill 0.3 pad 0.25 layers 1-15)
  Top 0.254: U$2.35 46.72,54.17 46.86,54.24 v47.18,54.68 | v62.06,54.56 62.06,54.47 62.29,54.24 63.44,54.24 U$3.2
  Route2 0.305: v47.18,54.68 47.2,55.07 48.08,55.95 56.44,55.95 57.87,57.37 59.25,57.37 v62.06,54.56
CONFIG_N3  (via drill 0.3 pad 0.25 layers 1-15)
  Top 0.254: U$3.35 71.99,54.23 v72.32,54.66 | v87.19,54.53 87.23,54.41 87.38,54.23 88.62,54.24 U$4.2
  Route2 0.254: 72.32,55.5 72.75,55.93 | 81.37,55.93 83.09,57.65 83.12,57.62 | v87.19,54.53 87.14,54.6
  Route2 0.305: v72.32,54.66 72.32,55.5 | 72.75,55.93 81.37,55.93 | 87.14,54.6 84.12,57.62 83.12,57.62
CONFIG_N4  (via drill 0.3 pad 0.25 layers 1-15)
  Top 0.254: U$4.35 97.13,54.22 97.21,54.31 v97.55,54.65 | 112.46,54.21 v112.45,54.5 112.49,54.46 112.49,54.18 113.79,54.18 U$5.2
  Route2 0.254: 106.77,55.87 108.58,57.68
  Route2 0.305: v97.55,54.65 97.55,55.32 98.2,55.87 106.77,55.87 | 108.58,57.68 109.29,57.69 v112.45,54.5
CONFIG_N5  (via drill 0.3 layers 1-15)
  Top 0.254: U$6.2 12.12,31.49 v11.78,31.83 | U$5.35 120.7,54.17 122.3,54.17 v122.73,54.6
  Route2 0.254: 11.71,31.76 v11.78,31.83 10.99,32.43 10.99,33.45 11.39,33.85 11.39,39.42
  Route2 0.305: 11.39,39.42 13.31,41.34 122.68,41.34 128.01,46.67 128.01,54.68 125.61,57.05 125.18,57.05 v122.73,54.6
CONFIG_N6  (via drill 0.3 pad 0.25 layers 1-15)
  Top 0.254: U$6.35 21.44,31.49 v22.04,32.08 | U$7.2 37.17,31.6 v36.88,31.92
  Route2 0.305: v22.04,32.08 23.08,33.14 30.26,33.09 32.12,34.96 32.27,35.01 34.03,35.01 36.77,32.27 v36.88,31.92
CONFIG_N7  (via drill 0.3 pad 0.25 layers 1-15)
  Top 0.254: 46.98,31.93 v47.15,32.1 46.65,31.6 U$7.35 | v61.99,31.86 v62,31.86 62.3,31.56 U$8.2
  Route2 0.254: 61.91,32.06 v61.99,31.86
  Route2 0.305: v47.15,32.1 47.21,32.4 48.02,33.21 55.97,33.21 57.76,35.03 58.95,35.03 59.06,34.91 61.91,32.06
CONFIG_N8  (via drill 0.3 pad 0.25 layers 1-15)
  Top 0.254: U$8.35 71.77,31.57 v72.27,32.07 | v87.17,31.82 87.26,31.75 87.45,31.56 U$9.2
  Route2 0.305: v72.27,32.07 72.27,32.39 73.08,33.2 80.31,33.2 82.13,35.02 83.81,35.02 v87.17,31.82
CONFIG_N9  (via drill 0.3 pad 0.25 layers 1-15)
  Top 0.254: U$9.35 96.96,31.55 v97.47,32.06 | 112.26,31.75 112.3,31.75 | 112.3,31.75 112.53,31.52 U$10.2 | 112.3,31.75 112.3,31.76 v112.35,31.81
  Route2 0.305: v97.47,32.06 98.65,33.24 105.76,33.24 107.59,35.07 108.92,35.07 v112.35,31.81
CONFIG_N10  (via drill 0.3 pad 0.25 layers 1-15)
  Top 0.254: U$10.35 122.09,31.52 v122.66,32.1
  Route2 0.406: 80.91,6.26 90.79,16.21 119.37,16.21 119.52,16.3 124.23,21.01 124.23,30.32 v122.66,32.1
  Route2 0.61: 80.91,6.26 73.33,6.3 73.33,8.15 73.33,11.67 72.52,12.48 71.19,13.82 PL1.10
CONFIG_P  (via drill 0.3 layers 1-15)
  Top 0.254: v12.23,56.03 12.23,55.59 U$1.1
  Route2 0.254: v12.24,56.04 v12.23,56.03 | 11.05,58.36 11.05,58.35
  Route2 0.406: 11.05,58.35 12.24,57.18 v12.24,56.04 | 11.05,58.36 6.84,58.34 4.1,55.63 4.1,12.6 8.35,8.35 39.88,8.35 42.74,11.21
  Route2 0.61: 42.74,11.21 47.71,11.21 53.37,5.56 56.85,5.56 58.59,7.3 58.59,9.44 PL1.6
CONFIG_P1  (via drill 0.3 layers 1-15)
  Top 0.254: U$1.36 20.74,54.66 21.49,55.25 v21.51,56.18
  Top 0.305: v37.43,56.02 37.43,55.53 U$2.1
  Route2 0.254: v37.42,56.03 v37.43,56.02
  Route2 0.305: v21.51,56.18 22.54,56.17 22.97,56.54 30.73,56.54 32.16,58.01 35.44,58.01 v37.43,56.02
CONFIG_P2  (via drill 0.3 pad 0.25 layers 1-15)
  Top 0.254: U$2.36 45.65,54.67 46.32,55.34 46.32,55.82 v46.53,56.19 | U$3.1 62.7,55.48 62.7,56 v62.67,56.03
  Route2 0.254: v46.53,56.19 46.49,56.23 46.41,56.22
  Route2 0.305: 46.41,56.22 46.79,56.6 56.12,56.6 57.76,58.24 60.46,58.24 v62.67,56.03
CONFIG_P3  (via drill 0.3 pad 0.25 layers 1-15)
  Top 0.254: U$3.36 70.65,54.73 71.73,55.92 v71.74,56.25 | 88.43,54.73 U$4.1 | 88.38,54.74 88.62,54.74 U$4.1 | v87.71,56.06 87.71,55.65 U$4.1
  Route2 0.254: v71.74,56.25 71.73,56.23
  Route2 0.305: 71.73,56.23 72.09,56.59 81.06,56.59 82.75,58.31 85.46,58.3 v87.71,56.06
CONFIG_P4  (via drill 0.3 pad 0.25 layers 1-15)
  Top 0.254: U$4.36 95.84,54.73 96.78,55.67 v96.83,56.26 | 113.59,54.68 U$5.1 112.94,55.55 v112.94,56
  Route2 0.305: v96.83,56.26 97.33,56.67 106.46,56.67 108.58,58.81 110.13,58.8 v112.94,56
CONFIG_P5  (via drill 0.3 layers 1-15, 0.3 pad 0.25 layers 1-15)
  Top 0.254: U$5.36 121.06,54.69 122.14,55.75 v122.15,56.21 | 13.12,31.98 U$6.1 12.23,32.89 v12.23,33.15
  Route2 0.254: v122.15,56.21 122.09,56.2
  Route2 0.305: 122.09,56.2 123.98,58.09 125.83,58.09 128.92,55 128.92,46.24 123.2,40.52 13.55,40.52 12.19,39.16 v12.23,33.15
CONFIG_P6  (via drill 0.3 pad 0.25 layers 1-15)
  Top 0.254: U$6.36 20.52,31.99 21.17,32.64 21.17,33.03 v21.52,33.51 | v37.43,33.11 37.43,32.92 U$7.1
  Route2 0.254: v21.52,33.51 v21.53,33.5
  Route2 0.305: v21.53,33.5 22.45,34.42 30,34.42 31.4,35.84 34.69,35.84 v37.43,33.11
CONFIG_P7  (via drill 0.3 pad 0.25 layers 1-15)
  Top 0.254: U$7.36 45.5,32.1 46.31,32.91 46.31,33.22 v46.45,33.63 | 63.41,32.07 U$8.1 62.67,32.81 v62.67,33.11
  Route2 0.305: v46.45,33.63 46.44,33.53 47.37,34.46 55.75,34.46 57.19,35.9 59.88,35.91 v62.67,33.11
CONFIG_P8  (via drill 0.3 pad 0.25 layers 1-15)
  Top 0.254: U$8.36 70.85,32.06 71.52,32.73 71.52,33.2 v71.62,33.57 | v87.71,33.18 87.71,32.95 U$9.1
  Route2 0.254: v71.62,33.57 71.49,33.52
  Route2 0.305: 71.49,33.52 72.4,34.43 80.29,34.43 81.71,35.85 84.9,35.85 v87.71,33.18
CONFIG_P9  (via drill 0.3 pad 0.25 layers 1-15)
  Top 0.254: U$9.36 95.94,32.06 96.75,32.87 96.75,33.2 v96.83,33.59 | v112.94,33.16 112.94,32.85 U$10.1
  Route2 0.254: v96.83,33.59 96.78,33.36
  Route2 0.305: 96.78,33.36 97.88,34.46 105.62,34.46 107.03,35.87 109.64,35.87 v112.94,33.16
CONFIG_P10  (via drill 0.3 pad 0.25 layers 1-15)
  Top 0.254: U$10.36 121.11,32.02 121.96,32.87 121.96,33.12 v121.99,33.59
  Route2 0.406: v121.99,33.59 126.92,33.59 129.16,31.35 129.16,24.09 120.21,15.14 91.5,15.16 80.84,4.49
  Route2 0.61: 80.84,4.49 71.48,4.51 69.09,6.89 69.12,10.39 69.15,15.8 69.78,16.43 75.02,16.43 75.44,16.05 75.44,13.99 PL1.9
GND  (via drill 0.3, 0.3 pad 0.25, 0.5, 3.8 pad 6.45)
  Top 0.254: U$1.5 14.42,52.66 14.45,52.69 14.61,52.69 | 14.61,52.69 16.54,52.69 16.66,52.81 16.66,52.78 | 16.66,52.78 16.66,51.97 U$1.49 | U$1.8 15.85,51.16 | 15.85,51.16 16.04,51.35 | 16.04,51.35 U$1.49 | 16.85,52.16 U$1.49 | 17.35,50.04 16.62,50.77 | 16.62,50.77 16.04,51.35 | 7.97,53.16 C2.1 7.49,53.16 v7.05,53.17 | 25.22,54.42 25.18,54.38 C8.2 25.37,54.38 v26.36,53.39 | C5.2 16.52,44.28 18.18,44.28 18.15,44.31 | 20,44.27 C4.2 | C7.2 26.05,50.02 v26.3,50.02 | C10.2 21.82,60.76 v21.48,61.1 | C12.2 v18.01,57.91 18.01,59.66 17.97,59.74 C9.2 | C11.2 8.19,55.19 v8.19,56.44 v8.2,56.45 | v6.55,48.36 C3.2 | v10.9,61.41 10.9,59.8 C6.2 | v18.15,45.08 v18.14,45.09 | 16.37,50.52 17.74,50.52 17.74,50.4 18.13,50.4 18.12,50.41 17.62,50.41 v17.62,53.95 | U$2.5 39.55,52.67 39.58,52.7 41.67,52.7 41.79,52.82 41.79,51.98 U$2.49 | U$2.8 40.62,51.17 | 41.17,51.36 40.98,51.17 40.62,51.17 | 41.17,51.36 U$2.49 | 41.98,53.43 41.98,52.17 U$2.49 | 42.48,50.05 41.96,50.57 | 41.96,50.57 41.17,51.36 | 42.48,51.31 42.58,51.41 | 42.58,51.41 42.71,51.55 42.71,51.92 | U$2.23 43.98,50 43.44,50.55 | 43.44,50.55 42.58,51.41 | U$2.38 43.98,52.81 43.83,52.66 43.83,53.42 | 33.1,53.17 C14.1 33.24,53.19 32.58,53.19 v32.2,53.11 | 50.35,54.43 50.31,54.39 C20.2 50.5,54.39 v51.49,53.4 | 41.65,44.29 C17.2 | 45.13,44.28 C16.2 | C19.2 51.19,50.03 v51.43,50.03 | 43.28,44.32 43.31,44.29 | C22.2 46.95,60.77 v46.61,61.11 | C24.2 v43.14,57.92 43.14,59.72 43.1,59.75 C21.2 | C23.2 33.32,55.2 v33.32,56.45 v33.33,56.46 | 33.3,48.36 C15.2 | v36.03,61.3 36.03,59.81 C18.2 | v43.28,45.09 v43.27,45.1 | 40.62,53.43 40.62,51.94 | 40.62,51.94 40.62,51.17 | U$3.5 64.71,52.73 64.74,52.76 66.83,52.76 66.95,52.88 66.95,52.04 66.91,52
  Top 0.254: U$3.8 65.78,51.23 | 66.33,51.42 66.14,51.23 65.78,51.23 | 66.33,51.42 U$3.49 | 67.14,52.23 66.91,52 | 66.91,52 U$3.49 | 67.64,50.11 67.12,50.63 | 67.12,50.63 66.33,51.42 | 67.64,51.37 67.73,51.47 | 67.73,51.47 68.39,52.12 | 68.39,52.12 68.99,52.72 69.06,52.8 | U$3.23 69.14,50.06 68.48,50.72 | 68.48,50.72 67.73,51.47 | U$3.38 69.14,52.87 69.06,52.8 | C26.1 58.26,53.23 | 75.51,54.49 75.47,54.45 C32.2 75.66,54.45 v76.65,53.46 | C26.1 58.41,53.25 | C29.2 68.47,44.35 68.44,44.38 | 70.29,44.34 C28.2 | C31.2 76.34,50.09 v76.59,50.09 | C34.2 72.11,60.83 v71.75,61.11 | C36.2 v68.3,57.98 68.3,59.78 68.26,59.81 C33.2 | C35.2 58.48,55.26 v58.48,56.51 v58.49,56.52 | v56.84,48.43 C27.2 | v61.19,61.48 61.19,59.87 C30.2 | v68.44,45.15 v68.43,45.16 | 65.78,52 65.78,53.49 65.41,53.49 | 65.78,52 65.78,51.23 | 65.78,51.23 65.78,50.69 65.68,50.59 65.4,50.59 | U$4.5 89.89,52.73 89.92,52.76 90.88,52.76 | 90.88,52.76 92.01,52.76 92.13,52.88 92.13,52.04 U$4.49 | U$4.8 90.72,51.23 | 90.72,51.23 91.32,51.23 91.51,51.42 | 91.51,51.42 U$4.49 | U$4.49 92.32,52.23 92.32,53.46 92.09,53.46 | 92.82,50.11 92.23,50.7 | 92.23,50.7 91.51,51.42 | 92.92,51.47 92.82,51.37 92.82,50.46 93.61,50.46 | 92.92,51.47 93.41,51.96 | 93.41,51.96 94.17,52.72 94.32,52.87 | U$4.23 94.32,50.06 | 94.32,50.06 92.92,51.47 | C38.1 83.44,53.23 | 100.69,54.49 100.65,54.45 C44.2 100.84,54.45 v101.83,53.46 | C38.1 83.58,53.25 | C41.2 | 95.47,44.34 C40.2 | C43.2 101.53,50.09 v101.77,50.09 | 93.62,44.38 93.65,44.35 | C46.2 97.29,60.83 v96.95,61.12 | C48.2 v93.48,57.98 93.48,59.78 93.44,59.81 C45.2 | C47.2 83.66,55.26 v83.66,56.51 v83.67,56.52 | v82.02,48.43 C39.2 | v86.37,61.48 86.37,59.87 C42.2
  Top 0.254: v93.62,45.15 v93.61,45.16 | U$5.5 115.06,52.69 115.09,52.72 117.18,52.72 117.3,52.84 | 117.3,52.84 117.3,52 U$5.49 | U$5.8 116.13,51.19 | 116.68,51.38 116.49,51.19 116.13,51.19 | 116.68,51.38 U$5.49 | U$5.49 | 117.49,52.19 U$5.49 | 117.99,50.07 117.39,50.67 | 117.39,50.67 116.68,51.38 | 117.99,51.33 118.08,51.43 | 118.08,51.43 118.66,52 | 118.66,52 119.34,52.68 119.49,52.83 | U$5.23 119.49,50.02 119.05,50.47 | 119.05,50.47 118.08,51.43 | U$5.38 119.49,52.83 | C50.1 108.61,53.19 | 125.86,54.45 125.82,54.41 C56.2 126.01,54.41 v127,53.42 | C50.1 108.75,53.21 | C53.2 117.16,44.31 118.82,44.31 118.79,44.34 | 120.64,44.3 C52.2 | C55.2 126.69,50.05 v126.94,50.05 | C58.2 122.46,60.79 v122.12,61.13 | C60.2 v118.65,57.94 118.65,59.74 118.61,59.77 C57.2 | C59.2 108.83,55.22 v108.83,56.47 v108.84,56.48 | v107.19,48.39 C51.2 | v111.54,61.44 111.54,59.83 C54.2 | v118.79,45.11 v118.78,45.12 | 116.13,51.19 116.13,51.93 116.13,53.42 115.73,53.42 | U$10.5 115.03,30.02 115.06,30.05 115.73,30.05 | 115.73,30.05 117.15,30.05 117.27,30.17 117.27,29.33 U$10.49 | U$10.8 116.46,28.52 116.65,28.71 | 117.46,29.52 U$10.49 | 117.96,27.4 117.46,27.9 | 117.46,27.9 116.65,28.71 | 117.96,28.66 118.05,28.76 | 118.05,28.76 118.79,29.49 | 118.79,29.49 119.31,30.01 119.42,30.12 | U$10.23 119.46,27.35 118.05,28.76 | U$10.38 119.46,30.16 119.42,30.12 | 108.58,30.52 C110.1 108.72,30.54 108.08,30.54 v107.64,30.54 | 125.83,31.78 125.79,31.74 C116.2 125.98,31.74 v126.97,30.75 | C113.2 117.13,21.64 118.79,21.64 118.76,21.67 | 120.61,21.63 C112.2 | C115.2 126.67,27.38 v126.91,27.38 | C118.2 122.43,38.12 v122.09,38.46 | C120.2 v118.62,35.27 118.62,37.07 118.58,37.1 C117.2
  Top 0.254: C119.2 108.8,32.55 v108.8,33.8 v108.81,33.81 | C111.2 108.65,25.71 106.54,27.82 v104.95,27.82 | v111.51,38.77 111.51,37.16 C114.2 | v118.76,22.44 v118.75,22.45 | U$9.5 89.86,30.06 89.89,30.09 91.98,30.09 92.1,30.21 92.1,29.37 U$9.49 | U$9.8 90.94,28.56 | 90.94,28.56 91.29,28.56 | U$9.49 | 92.79,27.79 92.79,28.7 92.89,28.8 92.99,28.69 | U$9.23 94.29,27.39 92.99,28.69 | U$9.38 94.29,30.2 | 94.29,30.2 94.14,30.05 | C98.1 83.41,30.56 | 100.66,31.82 100.62,31.78 C104.2 100.81,31.78 v101.8,30.79 | C98.1 83.55,30.58 | 91.96,21.68 C101.2 | 95.44,21.67 C100.2 | C103.2 101.5,27.42 v101.74,27.82 | 93.59,21.71 93.62,21.68 | C106.2 97.26,38.16 v96.92,38.5 | C108.2 v93.45,35.31 93.45,37.11 93.41,37.14 C105.2 | C107.2 83.63,32.59 v83.63,33.84 v83.64,33.85 | v81.99,25.76 83.69,25.79 C99.2 | v86.34,38.81 86.34,37.2 C102.2 | v93.59,22.48 v93.58,22.49 | 90.93,29.3 90.93,30.79 90.53,30.79 | 90.93,29.3 90.93,28.02 | 90.93,28.02 90.83,27.92 | 90.83,27.92 92.67,27.92 | 92.67,27.92 93.18,27.92 | U$8.5 64.68,30.06 64.71,30.09 65.21,30.09 | 65.21,30.09 66.8,30.09 66.86,30.15 | 66.86,30.15 66.92,30.21 66.92,29.37 U$8.49 | U$8.8 66.11,28.56 66.3,28.75 | 66.3,28.75 U$8.49 | 67.61,27.44 66.3,28.75 | 67.61,28.7 67.7,28.8 | 67.7,28.8 68.96,30.05 69.11,30.2 U$8.38 | U$8.23 69.11,27.39 | 69.11,27.39 68.64,27.86 | 68.64,27.86 67.7,28.8 | C86.1 58.23,30.56 | C92.2 75.44,31.78 75.48,31.82 | C86.1 58.38,30.58 | 66.78,21.68 C89.2 | 70.26,21.67 C88.2 | C91.2 76.31,27.42 v76.56,27.42 | 68.41,21.71 68.44,21.68 | C92.2 75.63,31.78 v76.62,30.79 | C94.2 72.08,38.16 v71.74,38.5 | C96.2 v68.27,35.31 68.27,37.11 68.23,37.14 C93.2 | C95.2 58.45,32.59 v58.45,33.84 v58.46,33.85
  Top 0.254: v56.81,25.76 58.42,25.75 C87.2 | v61.16,38.81 61.16,37.2 C90.2 | v68.41,22.48 v68.4,22.49 | 65.75,27.92 65.75,30.81 65.34,30.81 | 65.75,27.92 66.78,27.92 | 66.78,27.92 68,27.92 68,27.81 68.36,27.81 68.64,27.81 68.64,27.86 | U$7.5 39.51,30.1 39.54,30.13 40.04,30.13 | 40.04,30.13 41.63,30.13 41.75,30.25 41.75,29.41 U$7.49 | U$7.8 40.94,28.6 41.13,28.79 | 41.13,28.79 U$7.49 | 42.44,27.48 42.16,27.77 | 42.16,27.77 41.13,28.79 | 42.44,28.74 42.53,28.84 | 42.53,28.84 43.1,29.41 | 43.1,29.41 43.79,30.09 43.94,30.24 | U$7.23 43.94,27.43 43.35,28.02 | 43.35,28.02 42.53,28.84 | U$7.38 43.94,30.24 | C74.1 33.06,30.6 | 50.31,31.86 50.27,31.82 C80.2 50.46,31.82 v51.45,30.83 | C74.1 33.2,30.62 | C77.2 41.61,21.72 43.27,21.72 43.24,21.75 | 45.09,21.71 C76.2 | C79.2 51.14,27.46 v51.39,27.46 | C82.2 46.91,38.2 v46.57,38.54 | C84.2 v43.1,35.35 43.1,37.15 43.06,37.18 C81.2 | C83.2 33.28,32.63 v33.28,33.88 v33.29,33.89 | 33.26,25.79 C75.2 33.26,25.81 32.63,25.81 30.62,27.82 v29.53,27.82 | v35.99,38.85 35.99,37.24 C78.2 | v43.24,22.52 v43.23,22.53 | 40.58,30.87 40.58,28.27 | 40.58,28.27 40.58,28.06 40.48,27.96 40.48,27.88 40.18,27.88 | U$6.5 14.39,29.99 | 14.39,29.99 14.42,30.02 16.51,30.02 16.63,30.14 16.63,29.3 U$6.49 | U$6.8 15.82,28.49 16.01,28.68 | 16.01,28.68 U$6.49 | 16.82,29.49 U$6.49 | 17.32,27.37 16.01,28.68 | 17.32,27.85 17.32,28.63 17.41,28.73 18.82,27.32 U$6.23 | U$6.38 18.82,30.13 18.76,30.07 | 18.76,30.07 18.67,29.98 18.31,29.63 18.31,29.26 18.07,29.26 | C62.1 7.94,30.49 | 25.19,31.75 25.15,31.71 C68.2 25.34,31.71 v26.33,30.72 | C62.1 8.08,30.51 | C65.2 16.49,21.61 18.15,21.61 18.12,21.64 | 19.97,21.6 C64.2 | C67.2 26.25,27.57 v26.27,27.82
  Top 0.254: C70.2 21.79,38.09 v21.45,38.43 | C72.2 v17.98,35.24 17.98,37.04 17.94,37.07 C69.2 | C71.2 8.16,32.52 v8.16,33.77 v8.17,33.78 | v6.52,25.69 8.13,25.68 C63.2 | v10.37,38.63 10.41,38.63 10.41,37.13 10.87,37.13 C66.2 | v18.12,22.41 v18.11,22.42 | 15.46,29.25 15.46,30.74 15.06,30.74 | 15.46,29.25 15.46,27.95 15.36,27.85 | 15.36,27.85 16.57,27.85 | 16.57,27.85 17.32,27.85 | C62.1 7.37,30.49 v7.01,30.46 | C74.1 v32.1,30.6 | C86.1 v57.28,30.53 | C98.1 82.87,30.56 v82.48,30.54 | C50.1 v107.65,53.19 | C38.1 82.77,53.23 v82.48,53.26 | C26.1 57.73,53.23 v57.31,53.24 | 15.85,51.16 15.85,50.41 15.1,50.41 13.62,49.16 U$1.12 | 116.18,27.98 116.1,27.98 116,27.88 116,27.76 115.7,27.76 | 116.18,27.98 116.65,27.98 116.65,28.71 | 90.93,28.02 90.94,28.02 90.94,28.56 | 17.32,27.85 17.71,27.85 17.71,27.74 18.08,27.74 | 116.13,51.19 116.13,50.65 116.03,50.55 116.03,50.43 | 40.62,51.17 40.62,50.63 40.52,50.53 40.52,50.44 40.23,50.44 | v14.56,53.95 15.22,53.4 15.49,53.13 15.49,50.62 15.39,50.52 16.37,50.52 | v15.58,53.95 16.61,52.83 16.66,52.78 | 15.11,51.91 15.11,52.19 14.61,52.69 | U$1.49 | 16.37,50.52 16.62,50.77 | 43.26,50.43 43.44,50.43 43.44,50.55 | 41.74,50.44 41.96,50.44 41.96,50.57 | 40.24,51.94 40.62,51.94 | 41.74,51.94 41.73,51.94 U$2.49 | 43.25,51.95 42.71,51.95 42.71,51.92 | 43.25,53.42 43.83,53.42 | 68.48,50.49 68.43,50.49 68.43,50.72 68.48,50.72 | 66.91,50.5 67.12,50.5 67.12,50.63 | 65.41,52 65.78,52 | U$3.49 66.91,51.98 66.91,52 | 68.42,52.01 68.39,52.01 68.39,52.12 | 90.58,50.47 90.62,50.47 90.62,50.45 90.72,50.45 90.72,51.23 | 92.09,50.47 92.23,50.47 92.23,50.7 | 90.59,53.46 90.88,53.46 90.88,52.76 | 93.6,51.98 93.41,51.98 93.41,51.96
  Top 0.254: U$4.49 92.09,51.98 92.09,51.97 | 90.59,51.97 91.51,51.97 91.51,51.42 | U$5.49 | 118.74,51.94 118.66,51.94 118.66,52 | 118.75,50.42 119.05,50.42 119.05,50.47 | 117.23,50.43 117.39,50.43 117.39,50.67 | 117.3,52.84 117.23,52.84 117.23,53.42 | 115.71,30.75 115.73,30.75 115.73,30.05 | 117.27,30.75 117.21,30.75 v117.21,30.29 | 115.71,29.26 115.73,29.26 115.73,30.05 | U$10.49 | 118.72,29.27 118.79,29.27 118.79,29.49 | 117.21,27.76 117.46,27.76 117.46,27.9 | 90.53,29.3 90.93,29.3 | v93.06,29.31 93.54,29.31 93.55,29.31 93.55,29.34 93.65,29.34 93.65,30.06 93.18,30.53 93.54,30.53 93.54,30.78 | v93.06,29.31 92.99,29.31 | 92.99,29.31 92.99,28.69 | 93.55,27.79 92.79,27.79 | 92.67,27.8 92.67,27.92 | 92.03,27.8 92.67,27.8 | 92.67,27.8 92.67,27.79 92.79,27.79 | 90.52,27.8 90.83,27.8 90.83,27.92 | 66.84,30.81 66.86,30.81 66.86,30.15 | 65.34,29.32 65.21,29.32 65.21,30.09 | U$8.49 66.84,29.31 66.84,29.32 | 66.84,27.82 66.78,27.82 66.78,27.92 | 65.33,27.82 65.65,27.82 65.65,27.92 65.75,27.92 | 40.04,29.38 40.04,30.13 | U$7.49 41.69,29.38 | 41.69,27.88 42.16,27.88 42.16,27.77 | 42.83,27.96 42.83,27.87 43.21,27.87 43.35,27.87 43.35,27.96 43.35,28.02 | 43.2,29.39 43.1,29.39 43.1,29.41 | 14.39,29.99 16.56,29.99 16.56,30.74 | 15.06,29.25 15.46,29.25 | U$6.49 | 16.56,27.75 16.57,27.75 16.57,27.85 | 15.36,27.85 15.05,27.85 15.05,27.75 | U$4.38 94.32,54.17 94.17,54.02 | 94.17,54.02 93.6,53.45 | U$13.4 76.12,38.82 75.84,38.54 75.84,32.25 C92.2 | v18.64,53.95 v17.62,53.95 | v17.62,53.95 v16.6,53.95 | v17.62,53.95 v18.64,53.95 | v40.67,28.33 40.58,28.33 40.58,28.27 | 92.99,29.31 v93.06,29.31 | v119.25,30.29 119.42,30.29 119.42,30.12 | v94.11,54.02 94.17,54.02
  Top 0.254: 43.83,53.42 43.77,53.42 v43.77,53.96 | U$1.27 18.64,50.16 v18.64,49.87 18.85,49.66 U$1.23 | U$1.38 18.85,54.65 18.85,54.16 v18.64,53.95 | U$2.27 43.77,50.17 v43.77,49.88 | U$2.12 38.76,49.17 39.07,49.48 v39.69,49.88 | U$3.12 63.93,49.23 64.3,49.6 v64.85,49.94 | U$3.27 68.93,50.23 v68.93,49.94 | U$4.27 94.4,50.23 v94.11,49.94 94.11,50.06 94.32,50.06 | U$5.27 119.28,50.19 v119.28,49.9 | U$10.27 119.54,27.52 v119.25,27.23 | U$10.12 114.24,26.52 114.59,26.87 v115.17,27.23 | U$5.12 114.29,49.19 114.62,49.52 v115.2,49.9 | U$4.12 89.1,49.23 89.51,49.64 v90.03,49.94 | U$9.27 94.37,27.56 v94.08,27.27 | U$8.27 69.19,27.56 v68.9,27.27 69.02,27.39 69.11,27.39 | U$6.27 18.61,27.49 v18.61,27.2 | v119.28,52.96 119.49,52.96 119.49,52.83 | v116.19,28.25 v116.18,28.25 116.18,27.98 | U$9.12 89.05,26.56 89.37,26.88 v90,27.27 | v94.08,30.33 94.29,30.2 | U$6.12 13.59,26.49 13.88,26.78 v14.53,27.2 | v15.55,29.24 15.46,29.25 | v18.61,30.26 18.76,30.07 | v42.75,51.92 42.71,51.92 | v68.93,53 68.93,52.93 69.06,52.8 | U$8.12 63.96,26.56 64.31,26.91 v64.82,27.27 | U$7.27 43.73,27.6 v43.73,27.31 | v43.73,30.37 43.94,30.37 43.94,30.24 | U$7.12 38.72,26.6 39.06,26.94 v39.65,27.31
  Top 0.406: v31.94,48.36 33.3,48.36 | 91.96,21.68 93.62,21.68 | U$11.4 30.66,37.46 v30.64,37.43 | U$12.4 106.14,38.38 v106.14,37.43
  Top 0.61: C1.1 16.52,44.28 | C5.2 20,44.27 | 18.15,44.31 v18.15,45.08 | C13.1 41.65,44.29 43.31,44.29 | C17.2 45.13,44.28 | 43.28,44.32 v43.28,45.09 | C25.1 C29.2 | C29.2 70.29,44.34 | 68.44,44.38 v68.44,45.15 | C37.1 C41.2 93.65,44.35 | C41.2 95.47,44.34 | 93.62,44.38 v93.62,45.15 | C49.1 117.16,44.31 | C53.2 120.64,44.3 | 118.79,44.34 v118.79,45.11 | C109.1 117.13,21.64 | C113.2 120.61,21.63 | 118.76,21.67 v118.76,22.44 | C97.1 91.96,21.68 | C101.2 95.44,21.67 | 93.59,21.71 v93.59,22.48 | C85.1 66.78,21.68 68.44,21.68 | C89.2 70.26,21.67 | 68.41,21.71 v68.41,22.48 | C73.1 41.61,21.72 | C77.2 45.09,21.71 | 43.24,21.75 v43.24,22.52 | C61.1 16.49,21.61 | C65.2 19.97,21.6 | 18.12,21.64 v18.12,22.41
  Route2 0.406: v18.14,45.09 21.37,45.09 v26.3,50.02
  Route15 0.254: 21.45,61.07 v21.48,61.1 | v18.02,57.92 v18.01,57.91 | 24.08,55.51 24.24,55.51 | 26.36,50.08 v26.3,50.02
  Route15 0.406: v10.37,38.63 8.17,36.45 v8.17,33.78 7.01,32.62 v7.01,30.46 7.01,26.18 v6.52,25.69 | v6.55,48.36 6.55,52.67 v7.05,53.17 7.05,55.3 v8.2,56.45
  Route15 0.61: v18.02,57.92 21.68,57.92 | 21.68,57.92 24.08,55.51 | v31.94,48.36 30.29,50.02 | 30.29,50.02 30.29,51.2 v32.2,53.11 33.32,54.23 v33.32,56.47 | v43.14,57.92 43.14,60.21 43.63,60.7 | v33.33,56.46 33.33,58.6 v36.03,61.3 36.63,61.3 37.03,61.7 42.63,61.7 43.63,60.7 | v18.01,57.91 17.92,58 17.92,61.07 17.16,61.88 14.48,61.88 14.22,61.41 v10.9,61.41 10.79,61.3 10.79,56.7 10.54,56.45 v8.2,56.45 | 21.68,57.92 21.68,60.91 v21.48,61.1 | 43.63,60.7 46.2,60.7 v46.61,61.11 | 24.24,55.51 v26.36,53.39 26.3,53.33 v26.3,50.02 | v18.64,51.91 20.47,50.08 26.36,50.08 30.23,50.08 30.29,50.02
  Bottom 0.254: v43.14,57.92 v43.14,57.93 C24.2 44.53,57.93 46.49,57.93 48.08,56.26 | 48.08,56.26 50.11,56.24 50.3,56.06 | 50.3,56.06 51.42,54.93 51.42,53.47 v51.49,53.4 51.49,50.09 v51.43,50.03 51.52,49.94 51.52,48.76 | v43.27,45.1 47.86,45.1 51.52,48.76 | v71.75,61.11 68.95,61.15 68.3,60.51 v68.3,57.98 v68.3,57.99 C36.2 69.61,57.97 71.6,57.98 73.27,56.31 75.27,56.3 75.42,56.15 | 75.42,56.15 76.58,54.99 76.58,53.53 v76.65,53.46 76.65,50.15 v76.59,50.09 76.68,50 76.68,48.82 | 56.83,48.58 v56.84,48.43 | 56.87,48.46 v56.84,48.43 | v61.19,61.48 60.92,61.48 58.49,59.05 58.49,56.96 | v68.43,45.16 73.02,45.16 76.68,48.82 | v96.95,61.12 94.11,61.12 93.48,60.51 v93.48,57.98 v93.48,57.99 C48.2 94.78,57.97 96.73,57.97 98.4,56.3 100.45,56.3 100.63,56.12 | 100.63,56.12 101.76,54.99 101.76,53.53 v101.83,53.46 101.83,50.15 v101.77,50.09 101.86,50 101.86,48.82 | 82.01,48.58 v82.02,48.43 | v82.02,48.43 82.05,48.46 82.05,53.14 | 86.1,61.48 83.67,59.05 v83.67,56.52 v83.66,56.53 82.69,56.53 82.05,55.89 82.05,53.14 | v93.61,45.16 98.2,45.16 101.86,48.82 | v122.12,61.13 119.31,61.13 118.65,60.47 v118.65,57.94 v118.66,57.95 C60.2 119.95,57.93 122.01,57.94 123.68,56.27 125.62,56.26 125.78,56.1 | 125.78,56.1 126.93,54.95 126.93,53.49 v127,53.42 127,50.11 v126.94,50.05 127.03,49.96 127.03,48.78 123.37,45.12 v118.78,45.12 | 107.18,48.54 v107.19,48.39 | v107.19,48.39 107.22,48.42 107.22,53.19 | v111.54,61.44 111.27,61.44 108.84,59.01 v108.84,56.48 108.79,56.43 107.83,56.43 107.22,55.82 107.22,53.19 | v122.09,38.46 119.28,38.46 118.62,37.8 v118.62,35.27 v118.62,35.28 C120.2 119.92,35.26 122,35.26 123.77,33.47 125.68,33.49 125.96,33.21
  Bottom 0.254: 125.96,33.21 126.9,32.28 126.9,30.82 v126.97,30.75 126.97,27.44 v126.91,27.38 127,27.29 127,26.11 123.34,22.45 v118.75,22.45 | v111.51,38.77 111.24,38.77 108.81,36.34 v108.81,33.81 107.82,33.81 107.19,33.18 107.19,30.46 | v101.74,27.82 101.8,27.48 v101.8,30.79 101.73,30.86 101.73,32.32 100.86,33.2 | v96.92,38.5 94.11,38.5 93.45,37.84 v93.45,35.31 v93.45,35.32 C108.2 94.75,35.3 96.73,35.3 98.4,33.63 100.42,33.63 100.86,33.2 | 81.98,25.91 v81.99,25.76 | v81.99,25.76 82.02,25.79 82.02,30.58 | v86.34,38.81 86.07,38.81 83.64,36.38 v83.64,33.85 82.74,33.85 82.02,33.13 82.02,30.58 | v93.58,22.49 96.99,22.49 101.83,27.33 v101.74,27.82 | v71.74,38.5 68.93,38.5 68.27,37.84 v68.27,35.31 v68.28,35.32 C96.2 69.58,35.3 71.47,35.31 73.14,33.64 75.24,33.63 75.53,33.35 | 75.53,33.35 76.55,32.32 76.55,30.86 v76.62,30.79 76.62,27.48 v76.56,27.42 76.65,27.33 76.65,26.15 | 56.8,25.91 v56.81,25.76 | v56.81,25.76 56.84,25.79 56.84,30.51 | v61.16,38.81 60.89,38.81 58.46,36.38 v58.46,33.85 57.48,33.85 56.84,33.21 56.84,30.51 | v68.4,22.49 72.99,22.49 76.65,26.15 | v46.57,38.54 43.76,38.54 43.1,37.88 v43.1,35.35 v43.1,35.36 C84.2 44.41,35.34 46.31,35.35 47.98,33.68 50.07,33.67 50.64,33.1 | 50.64,33.1 51.38,32.36 51.38,30.9 v51.45,30.83 51.45,27.52 v51.39,27.46 51.48,27.37 51.48,26.19 47.82,22.53 v43.23,22.53 | v35.99,38.85 35.72,38.85 33.29,36.42 v33.29,33.89 33.25,33.85 32.3,33.85 31.67,33.22 31.67,30.69 | v26.27,27.82 26.33,27.41 v26.33,30.72 26.26,30.79 26.26,32.25 25.56,32.95 | v21.45,38.43 18.64,38.43 17.98,37.77 v17.98,35.24 v17.98,35.25 C72.2 19.29,35.23 21.34,35.22 23.01,33.55 24.95,33.56 25.56,32.95
  Bottom 0.254: v18.11,22.42 21.52,22.42 26.36,27.26 v26.27,27.82 | 51.52,48.76 56.51,48.76 v56.84,48.43 | 76.68,48.82 81.63,48.82 v82.02,48.43 | 101.86,48.82 106.76,48.82 v107.19,48.39 | 76.65,26.15 81.6,26.15 v81.99,25.76 | 56.38,26.19 v56.81,25.76 | 31.67,30.69 31.69,27.82 v29.53,27.82 v26.27,27.82 | v32.1,30.6 31.73,30.63 31.67,30.69 | v57.28,30.53 56.89,30.56 56.84,30.51 | v82.48,30.54 82.02,30.58 | v107.64,30.54 107.29,30.56 107.19,30.46 | v107.65,53.19 107.22,53.19 | v82.48,53.26 82.15,53.24 82.05,53.14 | 58.49,56.96 56.81,55.67 56.81,53.24 | 56.81,53.24 56.81,48.79 v56.84,48.43 | 58.49,56.96 v58.49,56.52 | v57.31,53.24 56.81,53.24 | 48.08,56.26 48.8,56.25 | 125.96,33.21 123.28,30.53 119.25,30.53 v119.25,30.29 | 100.86,33.2 98.19,30.53 94.08,30.53 v94.08,30.33 | 50.64,33.1 48.12,30.57 43.73,30.57 v43.73,30.37 | 25.56,32.95 23.08,30.46 18.61,30.46 v18.61,30.26 | 75.53,33.35 72.71,30.53 68.9,30.53 v68.9,30.33 | 125.78,56.1 122.84,53.16 119.28,53.16 v119.28,52.96 | 100.63,56.12 97.71,53.2 94.11,53.2 v94.11,53 | 75.42,56.15 72.47,53.2 68.93,53.2 v68.93,53 | 50.3,56.06 47.86,53.62 43.77,53.62 v43.77,53.96 | v101.74,27.82 101.84,27.81 v104.95,27.82 107.19,27.82 107.19,30.46
  Bottom 0.406: v30.64,37.43 30.87,37.43 31.87,36.43 33.28,36.43 33.29,36.42 | v106.14,37.43 106.14,36.48 v108.81,33.81